# EAGLE schematic termo2 (EAGLE 6.2)
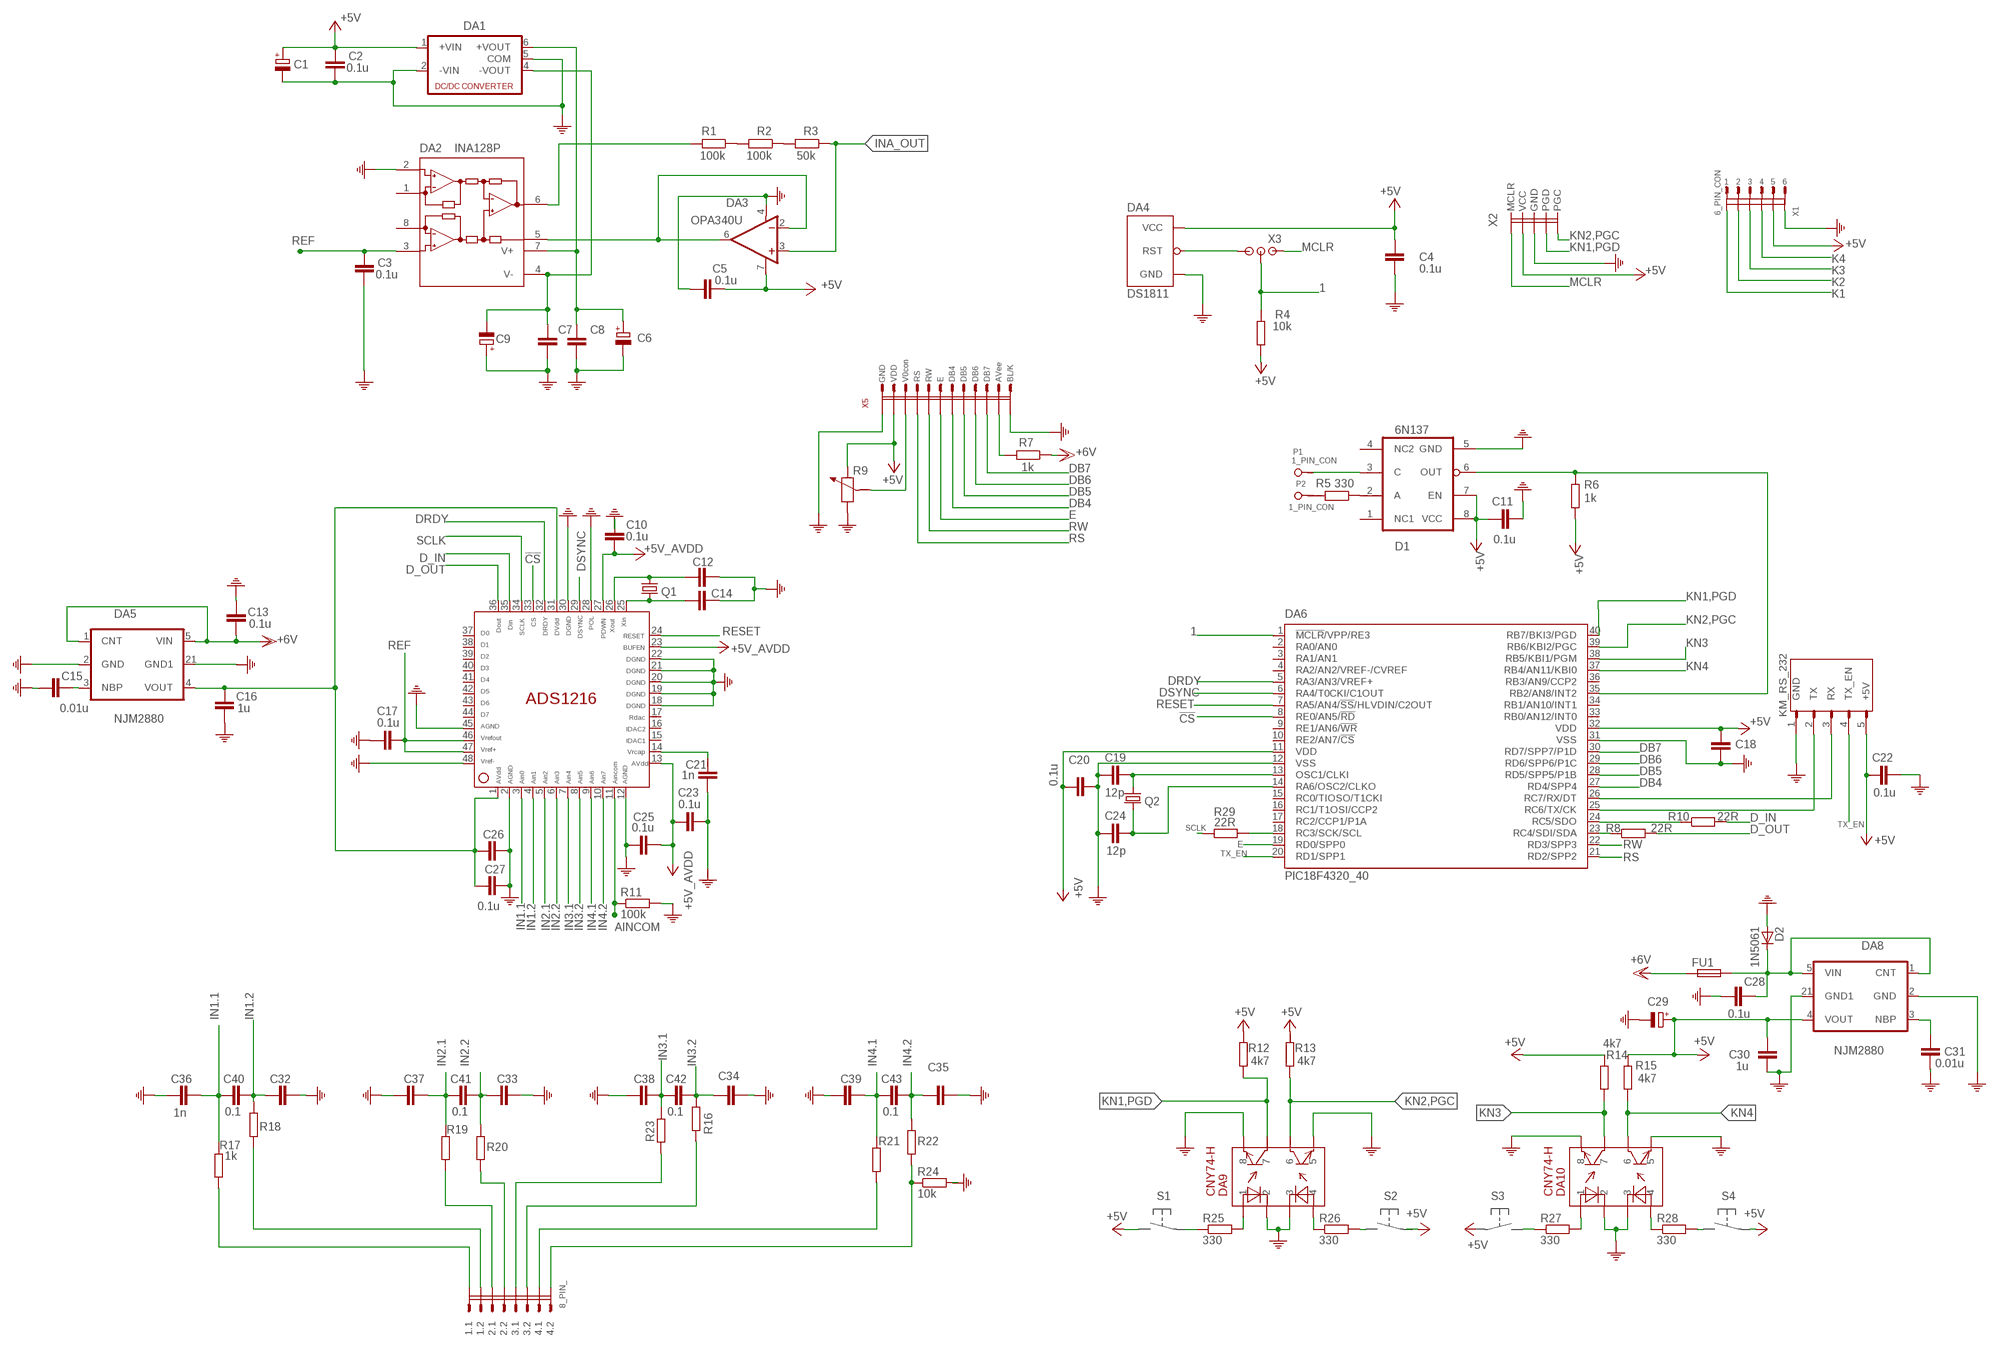
[diagram p0: schematic, sheet 1]

## Parts
8_PIN_  8_PIN_CON  [8_PIN_CON]
C1  C100MFX25V  [C100MILX6X12]
C2  0.1u  C0805  [C0805D]
C3  0.1u  C0805  [C0805D]
C4  0.1u  C0805  [C0805D]
C5  0.1u  C0805  [C0805D]
C6  C100MFX25V  [C100MILX6X12]
C7  C0805  [C0805D]
C8  C0805  [C0805D]
C9  C100MFX25V  [C100MILX6X12]
C10  0.1u  C-EUC0603  [C0603]
C11  0.1u  C0805  [C0805D]
C12  C0805  [C0805D]
C13  0.1u  C0805  [C0805D]
C14  C0805  [C0805D]
C15  0.01u  C0805  [C0805D]
C16  1u  C0805  [C0805D]
C17  0.1u  C-EUC0603  [C0603]
C18  C0805  [C0805D]
C19  12p  C0805  [C0805D]
C20  0.1u  C0805  [C0805D]
C21  1n  C-EUC0603  [C0603]
C22  0.1u  C0805  [C0805D]
C23  0.1u  C-EUC0603  [C0603]
C24  12p  C0805  [C0805D]
C25  0.1u  C-EUC0603  [C0603]
C26  C-EUC0603  [C0603]
C27  0.1u  C-EUC0603  [C0603]
C28  0.1u  C0805  [C0805D]
C29  C100MFX25V  [C100MILX6X12]
C30  1u  C0805  [C0805D]
C31  0.01u  C0805  [C0805D]
C32  C0805  [C0805D]
C33  C0805  [C0805D]
C34  C0805  [C0805D]
C35  C0805  [C0805D]
C36  1n  C0805  [C0805D]
C37  C0805  [C0805D]
C38  C0805  [C0805D]
C39  C0805  [C0805D]
C40  0.1  C0805  [C0805D]
C41  0.1  C0805  [C0805D]
C42  0.1  C0805  [C0805D]
C43  0.1  C0805  [C0805D]
D1  6N137  [DIL08]
D2  1N5061  [DO41-10]
DA1  NMA  [NMA]
DA2  INA128P  [DIL08]
DA3  OPA340U  [SO08]
DA4  DS1811  [TO92-60]
DA5  NJM2880  [SOT89-5]
DA6  PIC18F4320_40  PIC18F4455_40  [DIL40]
DA7  ADS1216ADS1216  ADS1216_1ADS1216  [ADS1216_PAC]
DA8  NJM2880  [SOT89-5]
DA9  CNY74-H  [CNY_DIP8]
DA10  CNY74-H  [CNY_DIP8]
FU1  FUSE5X20  [FUSE5X20]
P1  1_PIN_CON  [1_PIN_CON]
P2  1_PIN_CON  [1_PIN_CON]
Q1  CRYSTALHC49S  [HC49/S]
Q2  CRYSTALHC49S  [HC49/S]
R1  100k  R-EU_V235/17  [V235/17]
R2  100k  R-EU_V235/17  [V235/17]
R3  50k  R-EU_V235/17  [V235/17]
R4  10k  R0805  [R0805D]
R5  330  MLT025"  [0207/10]
R6  1k  MLT025"  [0207/10]
R7  1k  MLT025"  [0207/10]
R8  22R  R0805  [R0805D]
R9  RTRIM3329H  [RTRIM3329H]
R10  22R  R0805  [R0805D]
R11  100k  MLT025"  [0207/10]
R12  4k7  MLT025"  [0207/10]
R13  4k7  MLT025"  [0207/10]
R14  4k7  MLT025"  [0207/10]
R15  4k7  MLT025"  [0207/10]
R16  R0805  [R0805D]
R17  1k  R0805  [R0805D]
R18  R0805  [R0805D]
R19  R0805  [R0805D]
R20  R0805  [R0805D]
R21  R0805  [R0805D]
R22  R0805  [R0805D]
R23  R0805  [R0805D]
R24  10k  R0805  [R0805D]
R25  330  MLT025"  [0207/10]
R26  330  MLT025"  [0207/10]
R27  330  MLT025"  [0207/10]
R28  330  MLT025"  [0207/10]
R29  22R  R0805  [R0805D]
X1  6_PIN_CON  [6_IN_PINS]
X2  PIC_ISP_CONN  [PLC-5PIN]
X3  JP3PIN  [PLC-3PIN]
X4  KM_RS_232  [KM_RS_232]
X5  WINSTAR16X4DSPL_12  [WINSTAR16X4_12]

## Nets
1: DA6.1(!MCLR!/VPP/RE3) R4.P$1 X3.P$2
!CS!: DA7.33
+5V: C1.PLUS(+) C2.1 C4.2 C5.1 C11.2 C18.2 C20.1 C22.2 C29.PLUS(+) C30.1 D1.7(EN) D1.8(VCC) DA1.1(+VIN) DA3.7(V+) DA4.2(VCC) DA6.11(VDD) DA6.32(VDD) DA8.4(VOUT) R4.P$2 R6.2 R9.2 R12.2 R13.2 R14.2 R15.2 X1.P$5 X2.P$2(VCC) X4.5(+5V) X5.P$2(VDD)
+5V_AVDD: C10.2 C16.1 C23.2 C25.1 C26.2 C27.1 DA5.4(VOUT) DA7.1 DA7.13 DA7.23 DA7.27 DA7.31 ; supply symbol labelled +5V
+6V: C13.2 C28.2 D2.C DA5.1(CNT) DA5.5(VIN) DA8.1(CNT) DA8.5(VIN) FU1.P$2 R7.1
AINCOM: DA7.11 R11.1
D_IN: DA7.35 R10.P$2
D_OUT: DA7.36 R8.P$2
DB4: DA6.27(RD4/SPP4) X5.P$7(DB4)
DB5: DA6.28(RD5/SPP5/P1B) X5.P$8(DB5)
DB6: DA6.29(RD6/SPP6/P1C) X5.P$9(DB6)
DB7: DA6.30(RD7/SPP7/P1D) X5.P$10(DB7)
DRDY: DA6.5(RA3/AN3/VREF+) DA7.32
DSYNC: DA6.6(RA4/T0CKI/C1OUT) DA7.29
E: DA6.19(RD0/SPP0) X5.P$6(E)
IN1.1: C36.1 C40.1 DA7.3 R17.P$1
IN1.2: C32.1 C40.2 DA7.4 R18.P$1
IN2.1: C37.1 C41.1 DA7.5 R19.P$1
IN2.2: C33.1 C41.2 DA7.6 R20.P$1
IN3.1: C38.1 C42.1 DA7.7 R23.P$1
IN3.2: C34.1 C42.2 DA7.8 R16.P$1
IN4.1: C39.1 C43.1 DA7.9 R21.P$1
IN4.2: C35.1 C43.2 DA7.10 R22.P$1
INA_OUT: DA3.3(+IN) R3.1
K1: X1.P$1
K2: R26.2 X1.P$2
K3: R27.1 X1.P$3
K4: R28.2 X1.P$4
KN1,PGD: DA6.40(RB7/BKI3/PGD) DA9.7 R12.1 X2.P$4(PGD)
KN2,PGC: DA6.39(RB6/KBI2/PGC) DA9.6 R13.1 X2.P$5(PGC)
KN3: DA6.38(RB5/KBI1/PGM) DA10.7 R14.1
KN4: DA6.37(RB4/AN11/KBI0) DA10.6 R15.1
MCLR: X2.P$1(MCLR) X3.P$1
N$1: C19.2 DA6.13(OSC1/CLKI) Q2.1
N$2: C24.2 DA6.14(RA6/OSC2/CLKO) Q2.2
N$3: DA9.4 R26.1
N$4: C31.1 DA8.3(NBP)
N$5: D1.6(OUT) DA6.35(RB2/AN8/INT2) R6.1
N$6: DA6.18(RC3/SCK/SCL) R29.P$2
N$7: C21.2 DA7.14
N$8: DA4.1(RST) X3.P$3
N$9: DA6.24(RC5/SDO) R10.P$1
N$10: C14.2 DA7.25 Q1.2
N$11: C12.2 DA7.26 Q1.1
N$12: DA6.23(RC4/SDI/SDA) R8.P$1
N$13: 8_PIN_.P$6(3.2) R16.P$2
N$14: 8_PIN_.P$1(1.1) R17.P$2
N$15: 8_PIN_.P$2(1.2) R18.P$2
N$16: 8_PIN_.P$7(4.1) R21.P$2
N$17: DA10.1 R27.2
N$18: 8_PIN_.P$8(4.2) R22.P$2 R24.P$1
N$19: DA10.4 R28.1
N$20: R7.2 X5.P$11(AVEE)
N$28: 8_PIN_.P$5(3.1) R23.P$2
N$29: C6.PLUS(+) C8.1 DA1.6(+VOUT) DA2.7(V+)
N$30: 8_PIN_.P$3(2.1) R19.P$2
N$31: 8_PIN_.P$4(2.2) R20.P$2
N$45: DA2.5(REF) DA3.2(-IN) DA3.6(OUT)
N$47: DA2.6(OUT) R1.2
N$51: C7.1 C9.MINUS(-) DA1.4(-VOUT) DA2.4(V-)
N$56: DA6.26(RC7/RX/DT) X4.3(RX)
N$58: DA6.25(RC6/TX/CK) X4.2(TX)
N$62: R1.1 R2.2
N$63: R2.1 R3.2
N$105: C15.1 DA5.3(NBP)
N$106: R25.1
N$109: D1.2(A) R5.1
N$110: D1.3(C) P1.P$1
N$112: P2.P$1 R5.2
PE: C1.MINUS(-) C2.2 C3.2 C4.1 C5.2 C6.MINUS(-) C7.2 C8.2 C9.PLUS(+) C10.1 C11.1 C12.1 C13.1 C14.1 C15.2 C16.2 C17.2 C18.1 C19.1 C20.2 C21.1 C22.1 C23.1 C24.1 C25.2 C26.1 C27.2 C28.1 C29.MINUS(-) C30.2 C31.2 C32.2 C33.2 C34.2 C35.2 C36.2 C37.2 C38.2 C39.2 D1.5(GND) D2.A DA1.2(-VIN) DA1.5(COM) DA2.2(-IN) DA3.4(V-) DA4.3(GND) DA5.2(GND) DA5.21(GND1) DA6.12(VSS) DA6.31(VSS) DA7.2 DA7.12 DA7.18 DA7.19 DA7.20 DA7.21 DA7.22 DA7.28 DA7.30 DA7.45 DA7.48 DA8.2(GND) DA8.21(GND1) DA9.2 DA9.3 DA9.5 DA9.8 DA10.2 DA10.3 DA10.5 DA10.8 R9.1 R11.2 R24.P$2 X1.P$6 X2.P$3(GND) X4.1(GND) X5.P$1(GND) X5.P$12(KB/L) ; supply symbol labelled GND
R15: DA9.1 R25.2
REF: C3.1 C17.1 DA2.3(+IN) DA7.46 DA7.47
RESET: DA6.7(RA5/AN4/!SS!/HLVDIN/C2OUT) DA7.24
RS: DA6.21(RD2/SPP2) X5.P$4(RS)
RW: DA6.22(RD3/SPP3) X5.P$5(RW)
SCLK: DA7.34 R29.P$1
TX_EN: DA6.20(RD1/SPP1) X4.4(TX_EN)
V0CON: R9.3 X5.P$3(V0CON)
VDD: FU1.P$1 ; supply symbol labelled +6V
Unconnected: D1.1(NC1) D1.4(NC2) DA2.1(RG) DA2.8(RG) DA6.2(RA0/AN0) DA6.3(RA1/AN1) DA6.4(RA2/AN2/VREF-/CVREF) DA6.8(RE0/AN5/!RD!) DA6.9(RE1/AN6/!WR!) DA6.10(RE2/AN7/!CS!) DA6.15(RC0/TIOSO/T1CKI) DA6.16(RC1/T1OSI/CCP2) DA6.17(RC2/CCP1/P1A) DA6.33(RB0/AN12/INT0) DA6.34(RB1/AN10/INT1) DA6.36(RB3/AN9/CCP2) DA7.15 DA7.16 DA7.17 DA7.37 DA7.38 DA7.39 DA7.40 DA7.41 DA7.42 DA7.43 DA7.44

## Library data of the parts
8_PIN_ = Dmitry:8_PIN_CON
C1 C6 C9 C29 = den:C100MFX25V
C2-C5 C7 C8 C11-C16 C18-C20 C22 C24 C28 C30-C43 = den:C0805
C10 C17 C21 C23 C25-C27 = rcl:C-EU: CAPACITOR, European symbol
D1 = den:6N137
D2 = den:1N5061
DA1 = dc-dc-converter:NMA: DC-DC CONVERTER; MF: C & D TECHNOLOGIES, INC; MPN: NMA0515SC; OC_FARNELL: 1021434; OC_NEWARK: 61K3064
DA2 = burr-brown:INA128: Instrumentation Amplifiers Precision, Low Power; MF: TEXAS INSTRUMENTS; MPN: INA128P; OC_FARNELL: 1212410; OC_NEWARK: 74C9783
DA3 = burr-brown:OPA340: Rail-to-Rail Operational Amplifiers Single-Supply, MicroAmplifier(TM) Series; MPN: OPA340UA; OC_FARNELL: 1106196; OC_NEWARK: 24M5449
DA4 = den:DS1811
DA5 DA8 = den:NJM2880
DA6 = microchip:PIC18F4*_40: USB Microcontrollers with nanoWatt Technology High-Performance, Enhanced Flash, 28/40/44-Pin, Source: http://ww1.microchip.com/downloads/en/devicedoc/39632c.pdf; MF: MICROCHIP; MPN: PIC18F4455-I/P; OC_FARNELL: 9321314; OC_NEWARK: 05K2028
DA7 = Dmitry:ADS1216_1
DA9 DA10 = Dmitry:CNY74-H
FU1 = den:FUSE5X20
P1 P2 = Dmitry:1_PIN_CON
Q1 Q2 = crystal:CRYSTAL: CRYSTAL; OC_FARNELL: 1667008; OC_NEWARK: unknown
R1-R3 = rcl:R-EU_: RESISTOR, European symbol
R4 R8 R10 R16-R24 R29 = den:R0805
R5-R7 R11-R15 R25-R28 = den:MLT025
R9 = Dmitry:RTRIM3329H
X1 = Dmitry:6_PIN_CON
X2 = den:PIC_ISP_CONN
X3 = den:JP3PIN
X4 = Dmitry:KM_RS_232
X5 = Dmitry:WINSTAR16X4DSPL_12